# EAGLE design untitled (EAGLE 6.6.0)
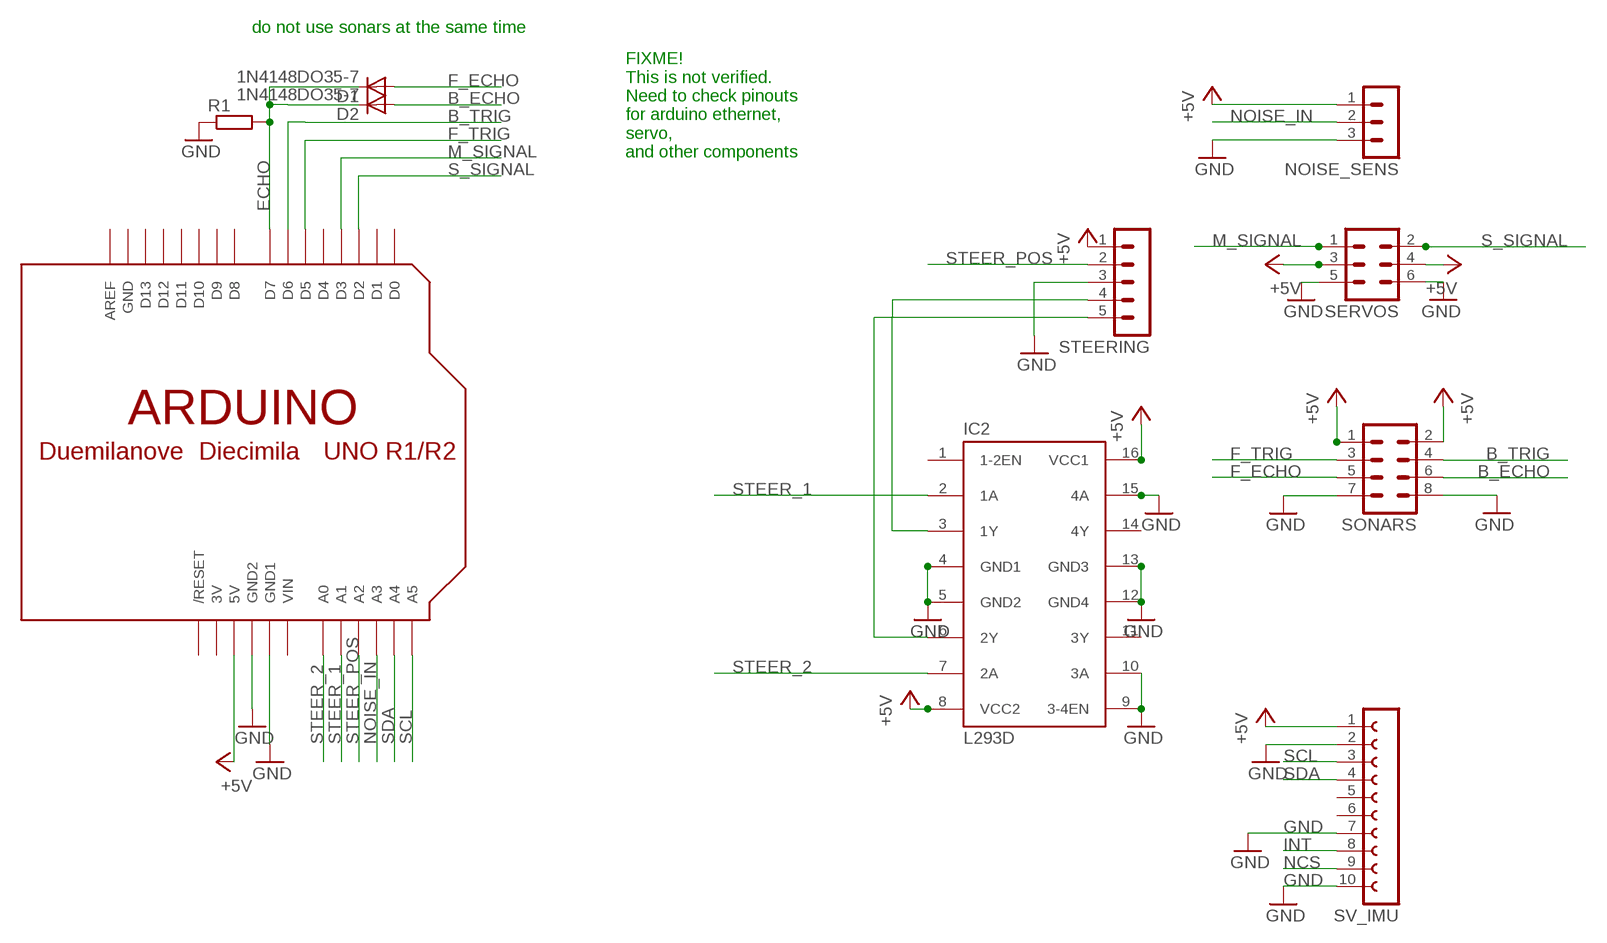
[diagram p0: schematic, sheet 1]

## Parts
D1  1N4148DO35-7  [DO35-7]
D2  1N4148DO35-7  [DO35-7]
IC2  L293D  [DIL16]
NOISE_SENS  MA03-1  [MA03-1]
R1  R-EU_0204/2V  [0204V]
SERVOS  MA03-2  [MA03-2]
SONARS  MA04-2  [MA04-2]
STEERING  MA05-1  [MA05-1]
SV_IMU  FE10-1  [FE10]
U$1  ARDUINOUNO  [ARDUINO]

## Nets
+5V: IC2.8(VCC2) IC2.16(VCC1) NOISE_SENS.1 SERVOS.3 SERVOS.4 SONARS.1 SONARS.2 STEERING.1 SV_IMU.1 U$1.5V
B_ECHO: D2.A SONARS.6
B_TRIG: SONARS.4 U$1.D6
ECHO: D1.C D2.C R1.2 U$1.D7
F_ECHO: D1.A SONARS.5
F_TRIG: SONARS.3 U$1.D5
GND: IC2.4(GND1) IC2.5(GND2) IC2.9(3-4EN) IC2.10(3A) IC2.12(GND4) IC2.13(GND3) IC2.15(4A) NOISE_SENS.3 R1.1 SERVOS.5 SERVOS.6 SONARS.7 SONARS.8 STEERING.3 SV_IMU.2 SV_IMU.7 SV_IMU.10 U$1.GND1 U$1.GND2
INT: SV_IMU.8
M_SIGNAL: SERVOS.1 U$1.D3
N$3: IC2.3(1Y) STEERING.4
N$4: IC2.6(2Y) STEERING.5
NCS: SV_IMU.9
NOISE_IN: NOISE_SENS.2 U$1.A3
S_SIGNAL: SERVOS.2 U$1.D2
SCL: SV_IMU.3 U$1.A5
SDA: SV_IMU.4 U$1.A4
STEER_1: IC2.2(1A) U$1.A1
STEER_2: IC2.7(2A) U$1.A0
STEER_POS: STEERING.2 U$1.A2
Unconnected: IC2.1(1-2EN) IC2.11(3Y) IC2.14(4Y) SV_IMU.5 SV_IMU.6 U$1.AREF U$1.D0 U$1.D1 U$1.D4 U$1.D8 U$1.D9 U$1.D10 U$1.D11 U$1.D12 U$1.D13 U$1.RESET(/RESET)

## Notes on the sheet
- do not use sonars at the same time
- FIXME!
  This is not verified.
  Need to check pinouts
  for arduino ethernet,
  servo,
  and other components

## Power pins joined to a net without a drawn wire
3V: U$1.3V
GND: U$1.GND
VIN: U$1.VIN

## Library data of the parts
D1 D2 = diode:1N4148: DIODE high speed (Philips)
IC2 = st-microelectronics:L293D: PUSH-PULL 4 CHANNEL DRIVER; MPN: L293D; OC_FARNELL: 9589619; OC_NEWARK: 56P8249
NOISE_SENS = con-lstb:MA03-1: PIN HEADER; OC_FARNELL: unknown; OC_NEWARK: unknown
R1 = rcl:R-EU_: RESISTOR, European symbol
SERVOS = con-lstb:MA03-2: PIN HEADER; OC_FARNELL: unknown; OC_NEWARK: unknown
SONARS = con-lstb:MA04-2: PIN HEADER; OC_FARNELL: unknown; OC_NEWARK: unknown
STEERING = con-lstb:MA05-1: PIN HEADER; OC_FARNELL: unknown; OC_NEWARK: unknown
SV_IMU = con-lsta:FE10-1: FEMALE HEADER; OC_FARNELL: unknown; OC_NEWARK: unknown
U$1 = adafruit:ARDUINO: Arduino Diecimila/Duemilanove Make a shield with ease, this package has all the named pins as well as the two mounting drill holes and an outline of the USB and DC power connector. The outline is on the DIMENSION layer, so if your board house uses it they will cut the outline to match. http://www.ladyada.net/library/pcb/eaglelibrary.html

## Board
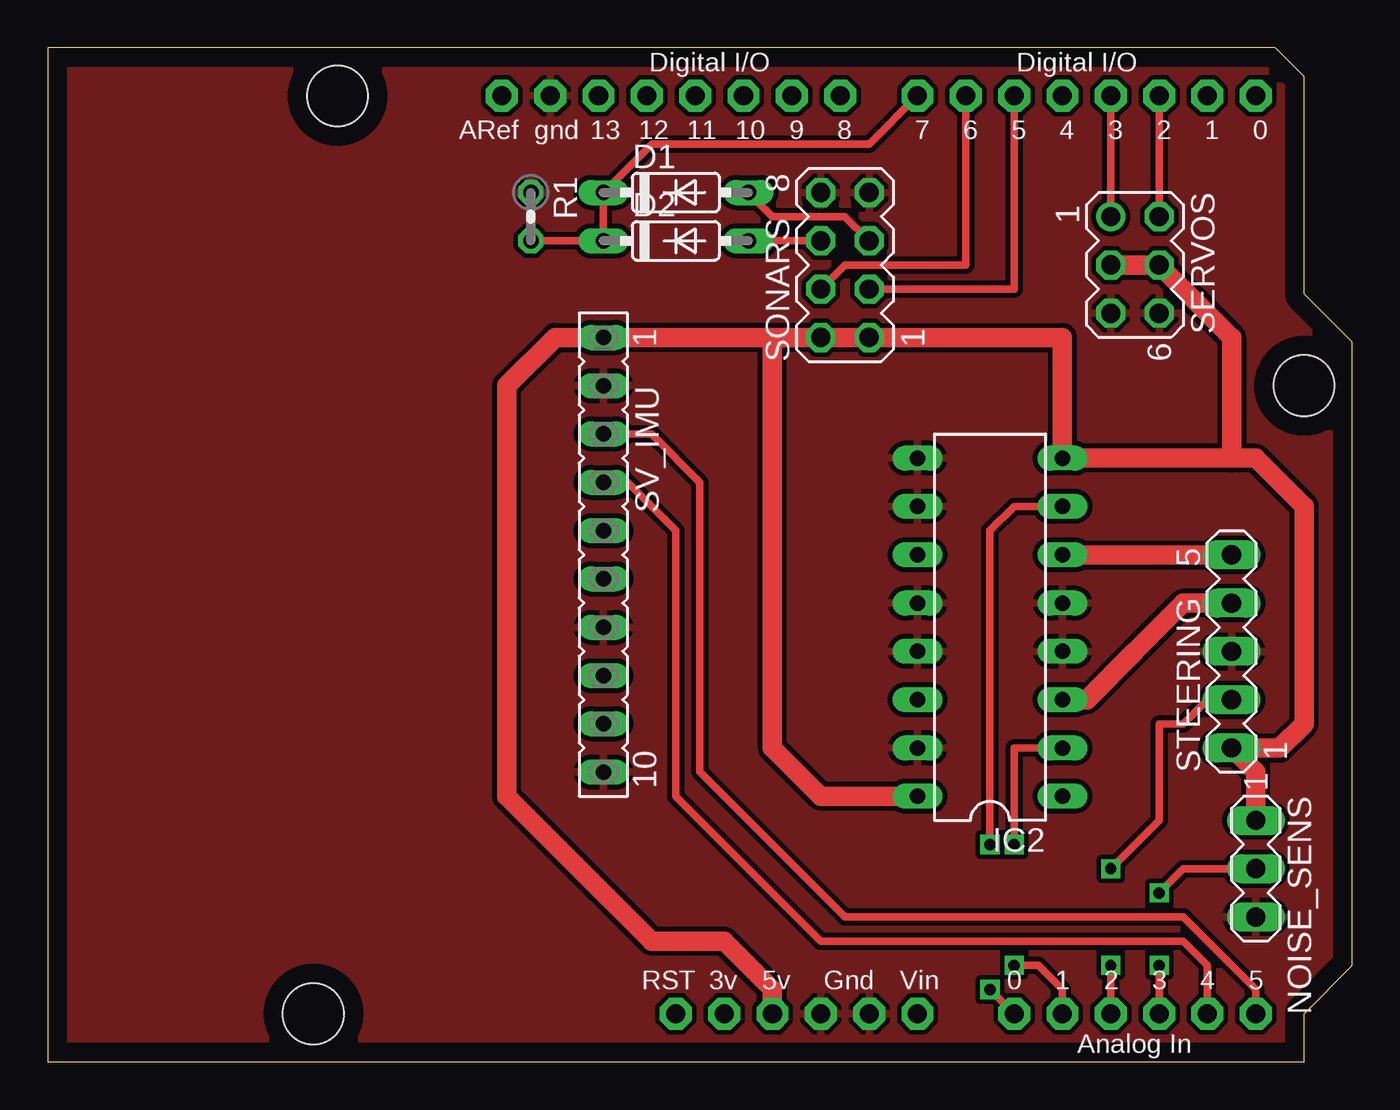
[diagram p1: board, top side]
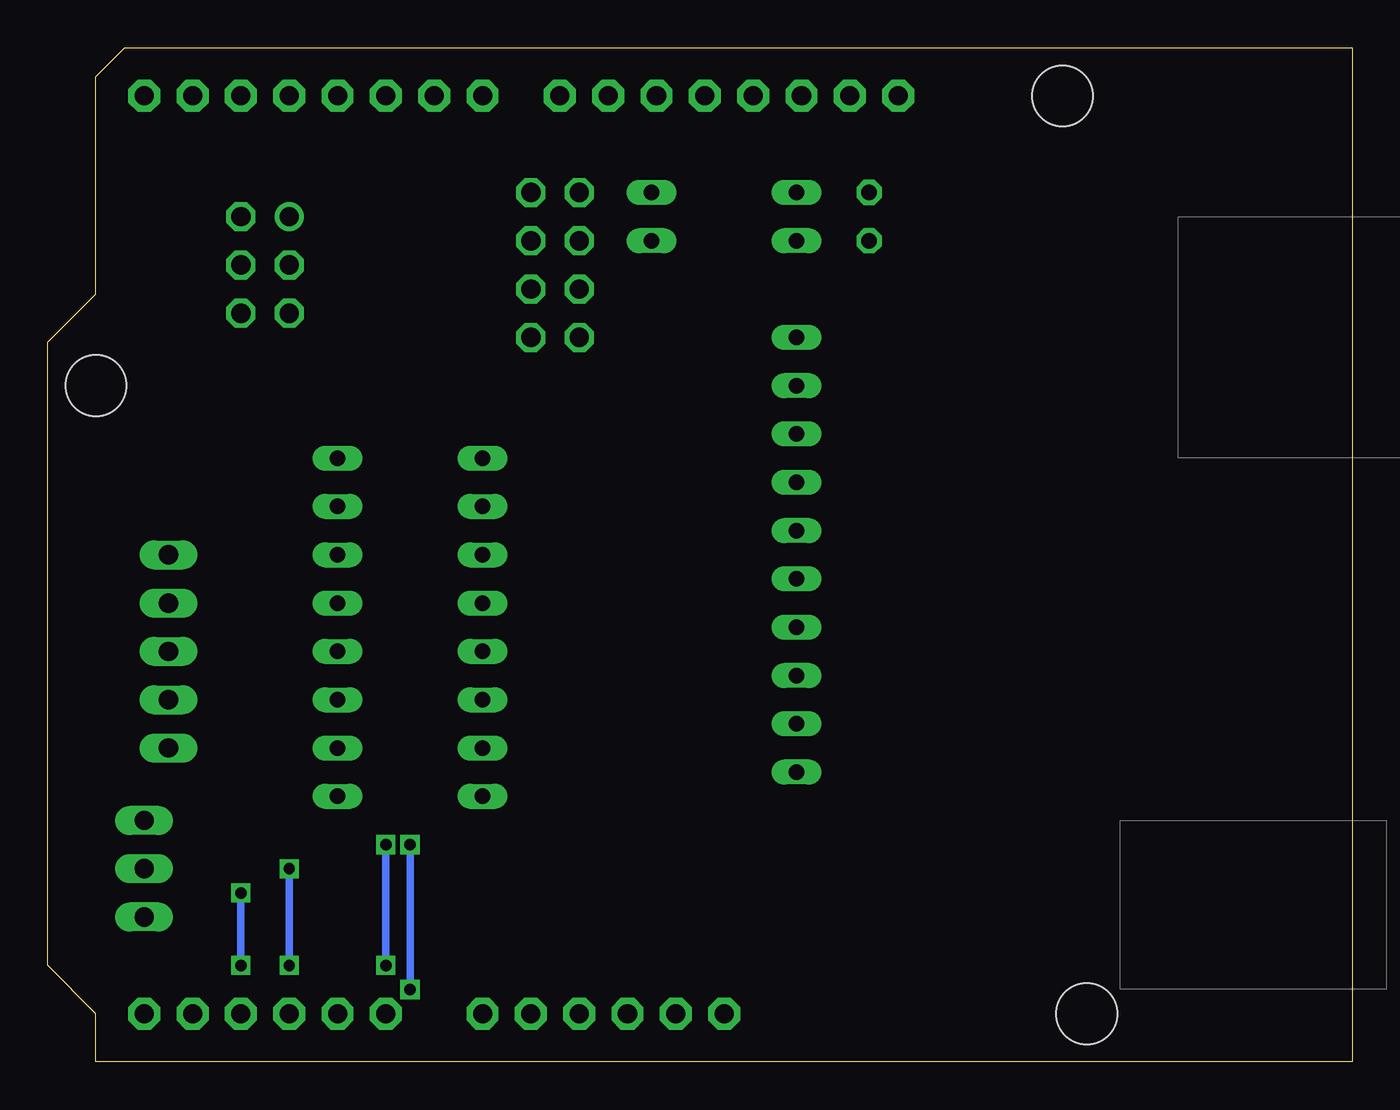
[diagram p2: board, bottom side, seen from below]

Size 68.58 x 53.34 mm. Coordinates in mm from the lower left corner, seen from the top.
Copper layers (1*16): Top 0.035mm / dielectric 1.5mm / Bottom 0.035mm
Design rules "default": minimum track width 10mil, minimum drill 24mil, track to track 8mil, track to pad 8mil, pad to pad 8mil, via to via 8mil, smd to smd 8mil, copper to edge 40mil, drill to drill 8mil, minimum pad ring 10mil, minimum via ring 8mil, stop-mask expansion 4mil, vias tented up to drill 0mil, thermal gap 10mil

### Footprints (pad centres in the part's own frame; a part is rotated, then mirrored left to right if it is on the bottom)
DO35-7 = drill 0.813 long: A 3.81,0; C -3.81,0
DIL16 = drill 0.813 long: 1 -8.89,-3.81; 2 -6.35,-3.81; 3 -3.81,-3.81; 4 -1.27,-3.81; 5 1.27,-3.81; 6 3.81,-3.81; 7 6.35,-3.81; 8 8.89,-3.81; 9 8.89,3.81; 10 6.35,3.81; 11 3.81,3.81; 12 1.27,3.81; 13 -1.27,3.81; 14 -3.81,3.81; 15 -6.35,3.81; 16 -8.89,3.81
MA03-1 = drill 1.016 long: 1 -2.54,0; 2 0,0; 3 2.54,0
0204V = drill 0.813 octagon: 1 -1.27,0; 2 1.27,0
MA03-2 = drill 1.016: 1 -2.54,-1.27 | drill 1.016 octagon: 2 -2.54,1.27; 3 0,-1.27; 4 0,1.27; 5 2.54,-1.27; 6 2.54,1.27
MA04-2 = drill 1.016 octagon: 1 -3.81,-1.27; 2 -3.81,1.27; 3 -1.27,-1.27; 4 -1.27,1.27; 5 1.27,-1.27; 6 1.27,1.27; 7 3.81,-1.27; 8 3.81,1.27
MA05-1 = drill 1.016 long: 1 -5.08,0; 2 -2.54,0; 3 0,0; 4 2.54,0; 5 5.08,0
FE10 = drill 0.813 long: 1 -11.43,0; 2 -8.89,0; 3 -6.35,0; 4 -3.81,0; 5 -1.27,0; 6 1.27,0; 7 3.81,0; 8 6.35,0; 9 8.89,0; 10 11.43,0
ARDUINO = drill 1 pad 1.676 octagon: 3V 35.56,2.54; 5V 38.1,2.54; A0 50.8,2.54; A1 53.34,2.54; A2 55.88,2.54; A3 58.42,2.54; A4 60.96,2.54; A5 63.5,2.54; AREF 23.876,50.8; D0 63.5,50.8; D1 60.96,50.8; D2 58.42,50.8; D3 55.88,50.8; D4 53.34,50.8; D5 50.8,50.8; D6 48.26,50.8; D7 45.72,50.8; D8 41.656,50.8; D9 39.116,50.8; D10 36.576,50.8; D11 34.036,50.8; D12 31.496,50.8; D13 28.956,50.8; GND 26.416,50.8; GND1 43.18,2.54; GND2 40.64,2.54; RESET 33.02,2.54; VIN 45.72,2.54 | hole 3.2: 15.24,50.8; 66.04,35.56; 13.97,2.54

### Placement (x,y rotation side)
D1  33.02,45.72 0 top
D2  33.02,43.18 0 top
IC2  49.53,22.86 90 top
NOISE_SENS  63.5,10.16 270 top
R1  25.4,44.45 270 top
SERVOS  57.15,41.91 270 top
SONARS  41.91,41.91 90 top
STEERING  62.23,21.59 90 top
SV_IMU  29.21,26.67 270 top
U$1  0,0 0 top

### Tracks (layer width: path | path; a pad name or v marks a point on that pad's centre or on a via)
+5V
  Top 1.016: U$1.5V 38.1,3.81 35.56,6.35 31.75,6.35 24.13,13.97 24.13,35.56 26.67,38.1 SV_IMU.1 33.02,38.1 35.56,38.1 38.1,38.1 | IC2.16 40.64,13.97 38.1,16.51 38.1,38.1 | NOISE_SENS.1 63.5,15.24 STEERING.1 64.77,16.51 66.04,17.78 66.04,29.21 63.5,31.75 62.23,31.75 | 62.23,31.75 IC2.8 53.34,38.1 SONARS.1 SONARS.2 38.1,38.1 | SERVOS.4 SERVOS.3 SERVOS.4 | SERVOS.4 62.23,38.1 62.23,31.75
B_ECHO
  Top 0.406: SONARS.6 D2.A
B_TRIG
  Top 0.406: SONARS.4 41.91,41.91 48.26,41.91 U$1.D6
ECHO
  Top 0.406: U$1.D7 43.18,48.26 31.75,48.26 D1.C D2.C R1.2
F_ECHO
  Top 0.406: SONARS.5 41.91,44.45 38.1,44.45 D1.A
F_TRIG
  Top 0.406: SONARS.3 50.8,40.64 U$1.D5
GND
  pour Top (isolate 0.254): 0,53.34 68.58,53.34 68.58,0 0,0
M_SIGNAL
  Top 0.406: SERVOS.1 U$1.D3
N$3
  Top 1.016: STEERING.4 59.69,24.13 57.15,21.59 54.61,19.05 IC2.3
N$4
  Top 1.016: IC2.6 STEERING.5
NOISE_IN  (via drill 0.6)
  Top 0.406: NOISE_SENS.2 59.69,10.16 v58.42,8.89 | U$1.A3 v58.42,5.08
  Bottom 0.406: v58.42,8.89 v58.42,5.08
S_SIGNAL
  Top 0.406: SERVOS.2 U$1.D2
SCL
  Top 0.406: U$1.A5 63.5,3.81 59.69,7.62 41.91,7.62 34.29,15.24 34.29,30.48 31.75,33.02 SV_IMU.3
SDA
  Top 0.406: U$1.A4 60.96,5.08 59.69,6.35 40.64,6.35 33.02,13.97 33.02,27.94 30.48,30.48 SV_IMU.4
STEER_1  (via drill 0.6)
  Top 0.406: IC2.2 50.8,16.51 50.8,15.24 v50.8,11.43 | v50.8,5.08 52.07,5.08 53.34,3.81 U$1.A1
  Bottom 0.406: v50.8,11.43 v50.8,5.08
STEER_2  (via drill 0.6)
  Top 0.406: IC2.7 50.8,29.21 49.53,27.94 49.53,22.86 v49.53,11.43 | v49.53,3.81 U$1.A0
  Bottom 0.406: v49.53,11.43 v49.53,3.81
STEER_POS  (via drill 0.6)
  Top 0.406: STEERING.2 60.96,19.05 59.69,17.78 58.42,17.78 58.42,12.7 v55.88,10.16 | U$1.A2 v55.88,5.08
  Bottom 0.406: v55.88,5.08 v55.88,10.16